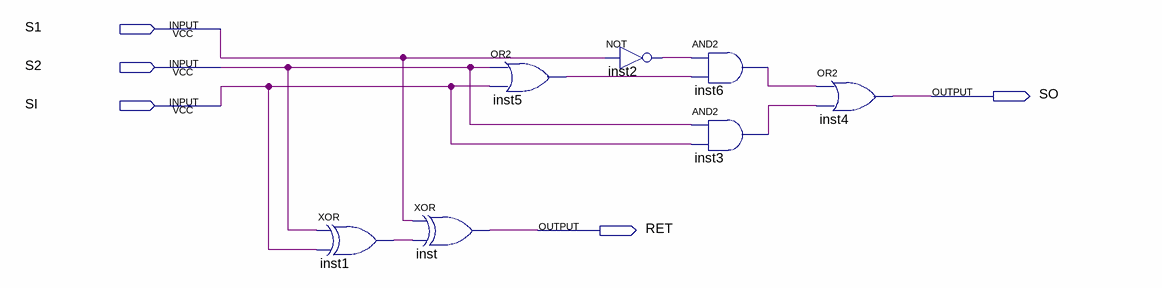
[diagram p0: schematic sheet]
// Quartus schematic suber.bdf as structural Verilog: 7 symbols, 5 pins
module suber (
  input  S1,
  input  S2,
  input  SI,
  output SO,
  output RET
);

  wire inst1_out, inst2_out, inst3_out, inst5_out, inst6_out;

  xor inst1 (inst1_out, S2, SI);
  xor inst (RET, S1, inst1_out);
  or inst5 (inst5_out, S2, SI);
  not inst2 (inst2_out, S1);
  and inst6 (inst6_out, inst2_out, inst5_out);
  and inst3 (inst3_out, S2, SI);
  or inst4 (SO, inst6_out, inst3_out);
endmodule
